# Altium schematic sheet Sheet1.SchDoc
size 381 x 241 mm
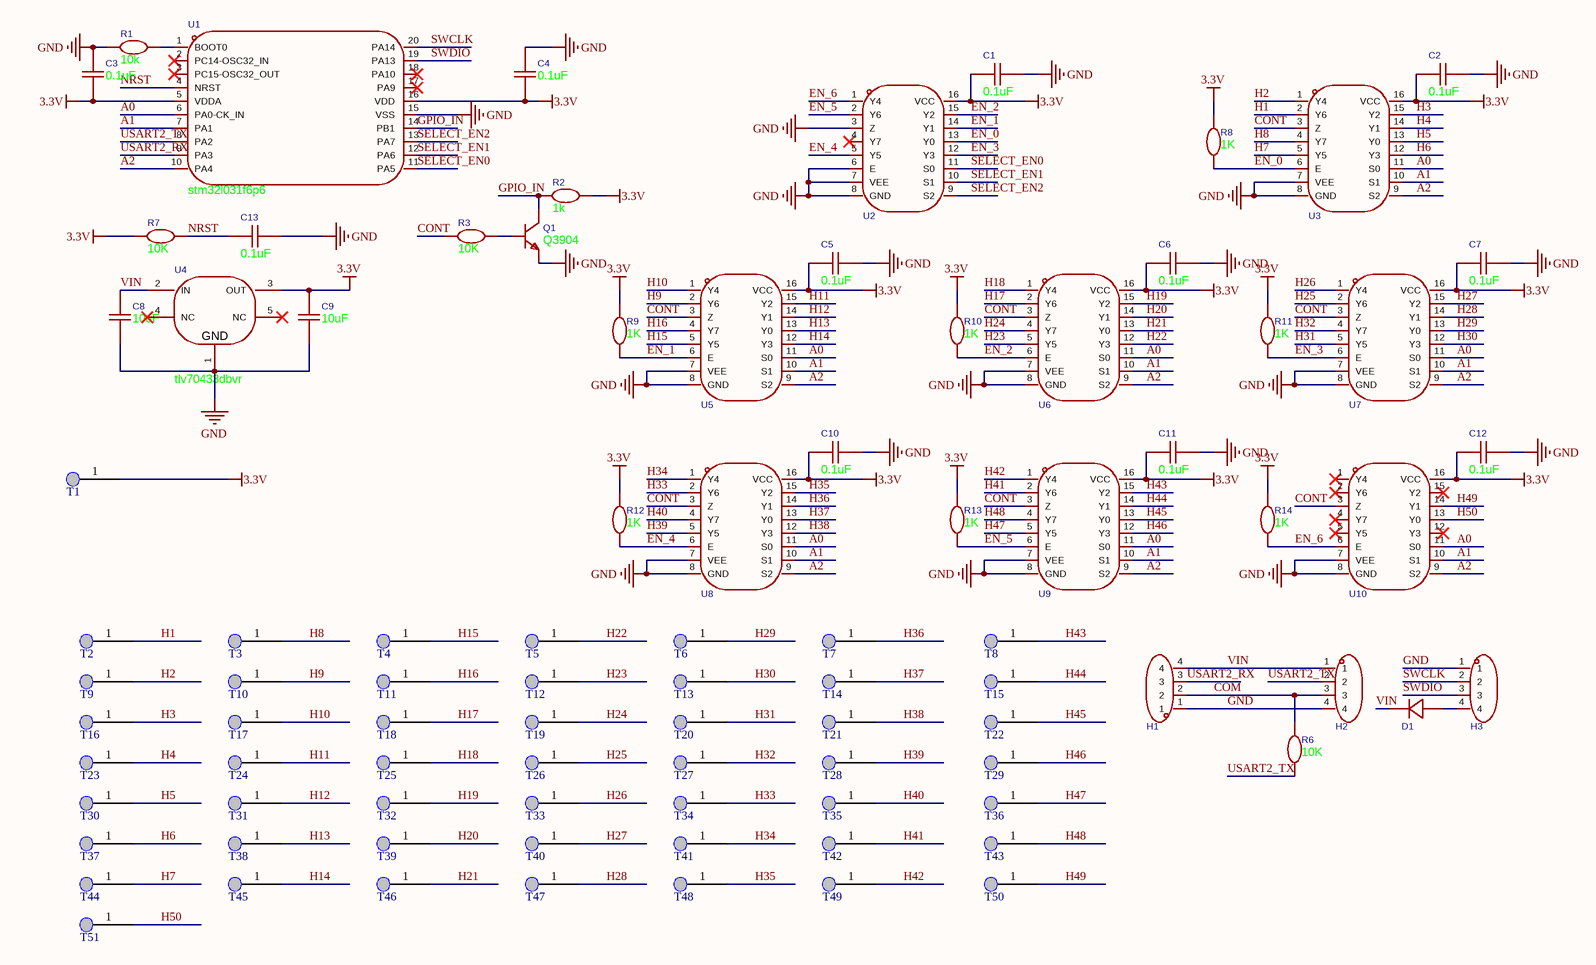
[diagram p0: Sheet1.SchDoc]

## Parts
C1  0.1uF  [C0603]
C2  0.1uF  [C0603]
C3  0.1uF  [C0603]
C4  0.1uF  [C0603]
C5  0.1uF  [C0603]
C6  0.1uF  [C0603]
C7  0.1uF  [C0603]
C8  10uF  [C0603]
C9  10uF  [C0603]
C10  0.1uF  [C0603]
C11  0.1uF  [C0603]
C12  0.1uF  [C0603]
C13  0.1uF  [C0603]
D1  1n4148ws_c7420319  [SOD-323_L1.7-W1.3-LS2.5-FD]  (value not drawn)
H1  pz254v-11-04p  [HDR-TH_4P-P2.54-V-M]  (value not drawn)
H2  pz254v-11-04p  [HDR-TH_4P-P2.54-V-M]  (value not drawn)
H3  pz254v-11-04p  [HDR-TH_4P-P2.54-V-M]  (value not drawn)
Q1  Q3904  [SOT-23-3_L2.9-W1.6-P1.90-LS2.8-BR]
R1  10k  [R0603]
R2  1k  [R0603]
R3  10K  [R0603]
R6  10K  [R0805]
R7  10K  [R0603]
R8  1K  [R0603]
R9  1K  [R0603]
R10  1K  [R0603]
R11  1K  [R0603]
R12  1K  [R0603]
R13  1K  [R0603]
R14  1K  [R0603]
T1  焊盘  [Contact]  (value not drawn)
T2  焊盘  [Contact]  (value not drawn)
T3  焊盘  [Contact]  (value not drawn)
T4  焊盘  [Contact]  (value not drawn)
T5  焊盘  [Contact]  (value not drawn)
T6  焊盘  [Contact]  (value not drawn)
T7  焊盘  [Contact]  (value not drawn)
T8  焊盘  [Contact]  (value not drawn)
T9  焊盘  [Contact]  (value not drawn)
T10  焊盘  [Contact]  (value not drawn)
T11  焊盘  [Contact]  (value not drawn)
T12  焊盘  [Contact]  (value not drawn)
T13  焊盘  [Contact]  (value not drawn)
T14  焊盘  [Contact]  (value not drawn)
T15  焊盘  [Contact]  (value not drawn)
T16  焊盘  [Contact]  (value not drawn)
T17  焊盘  [Contact]  (value not drawn)
T18  焊盘  [Contact]  (value not drawn)
T19  焊盘  [Contact]  (value not drawn)
T20  焊盘  [Contact]  (value not drawn)
T21  焊盘  [Contact]  (value not drawn)
T22  焊盘  [Contact]  (value not drawn)
T23  焊盘  [Contact]  (value not drawn)
T24  焊盘  [Contact]  (value not drawn)
T25  焊盘  [Contact]  (value not drawn)
T26  焊盘  [Contact]  (value not drawn)
T27  焊盘  [Contact]  (value not drawn)
T28  焊盘  [Contact]  (value not drawn)
T29  焊盘  [Contact]  (value not drawn)
T30  焊盘  [Contact]  (value not drawn)
T31  焊盘  [Contact]  (value not drawn)
T32  焊盘  [Contact]  (value not drawn)
T33  焊盘  [Contact]  (value not drawn)
T34  焊盘  [Contact]  (value not drawn)
T35  焊盘  [Contact]  (value not drawn)
T36  焊盘  [Contact]  (value not drawn)
T37  焊盘  [Contact]  (value not drawn)
T38  焊盘  [Contact]  (value not drawn)
T39  焊盘  [Contact]  (value not drawn)
T40  焊盘  [Contact]  (value not drawn)
T41  焊盘  [Contact]  (value not drawn)
T42  焊盘  [Contact]  (value not drawn)
T43  焊盘  [Contact]  (value not drawn)
T44  焊盘  [Contact]  (value not drawn)
T45  焊盘  [Contact]  (value not drawn)
T46  焊盘  [Contact]  (value not drawn)
T47  焊盘  [Contact]  (value not drawn)
T48  焊盘  [Contact]  (value not drawn)
T49  焊盘  [Contact]  (value not drawn)
T50  焊盘  [Contact]  (value not drawn)
T51  焊盘  [Contact]  (value not drawn)
U1  stm32l031f6p6  [TSSOP-20_L6.5-W4.4-P0.65-LS6.4-BL]
U2  74hc4051d,653  [SOIC-16_L9.9-W3.9-P1.27-LS6.0-BL]  (value not drawn)
U3  74hc4051d,653  [SOIC-16_L9.9-W3.9-P1.27-LS6.0-BL]  (value not drawn)
U4  tlv70433dbvr  [SOT-23-5_L3.0-W1.7-P0.95-LS2.8-BR]
U5  74hc4051d,653  [SOIC-16_L9.9-W3.9-P1.27-LS6.0-BL]  (value not drawn)
U6  74hc4051d,653  [SOIC-16_L9.9-W3.9-P1.27-LS6.0-BL]  (value not drawn)
U7  74hc4051d,653  [SOIC-16_L9.9-W3.9-P1.27-LS6.0-BL]  (value not drawn)
U8  74hc4051d,653  [SOIC-16_L9.9-W3.9-P1.27-LS6.0-BL]  (value not drawn)
U9  74hc4051d,653  [SOIC-16_L9.9-W3.9-P1.27-LS6.0-BL]  (value not drawn)
U10  74hc4051d,653  [SOIC-16_L9.9-W3.9-P1.27-LS6.0-BL]  (value not drawn)

## Nets
3.3V: C1.2 C2.2 C3.1 C4.1 C5.2 C6.2 C7.2 C9.2 C10.2 C11.2 C12.2 R2.1 R7.1 R8.2 R9.2 R10.2 R11.2 R12.2 R13.2 R14.2 T1.1 U1.5(VDDA) U1.16(VDD) U2.16(VCC) U3.16(VCC) U4.3(OUT) U5.16(VCC) U6.16(VCC) U7.16(VCC) U8.16(VCC) U9.16(VCC) U10.16(VCC)
GND: C1.1 C2.1 C3.2 C4.2 C5.1 C6.1 C7.1 C8.1 C9.1 C10.1 C11.1 C12.1 C13.2 H1.1 H2.4 H3.1 Q1.2 R1.1 U1.15(VSS) U2.3(Z) U2.6(E) U2.7(VEE) U2.8(GND) U3.7(VEE) U3.8(GND) U4.1(GND) U5.7(VEE) U5.8(GND) U6.7(VEE) U6.8(GND) U7.7(VEE) U7.8(GND) U8.7(VEE) U8.8(GND) U9.7(VEE) U9.8(GND) U10.7(VEE) U10.8(GND)
A0: U1.6(PA0-CK_IN) U3.11(S0) U5.11(S0) U6.11(S0) U7.11(S0) U8.11(S0) U9.11(S0) U10.11(S0)
A1: U1.7(PA1) U3.10(S1) U5.10(S1) U6.10(S1) U7.10(S1) U8.10(S1) U9.10(S1) U10.10(S1)
A2: U1.10(PA4) U3.9(S2) U5.9(S2) U6.9(S2) U7.9(S2) U8.9(S2) U9.9(S2) U10.9(S2)
COM: H1.2 H2.3 R6.2
CONT: R3.1 U3.3(Z) U5.3(Z) U6.3(Z) U7.3(Z) U8.3(Z) U9.3(Z) U10.3(Z)
EN_0: R8.1 U2.13(Y0) U3.6(E)
EN_1: R9.1 U2.14(Y1) U5.6(E)
EN_2: R10.1 U2.15(Y2) U6.6(E)
EN_3: R11.1 U2.12(Y3) U7.6(E)
EN_4: R12.1 U2.5(Y5) U8.6(E)
EN_5: R13.1 U2.2(Y6) U9.6(E)
EN_6: R14.1 U2.1(Y4) U10.6(E)
GPIO_IN: Q1.3 R2.2 U1.14(PB1)
H1: T2.1 U3.2(Y6)
H2: T9.1 U3.1(Y4)
H3: T16.1 U3.15(Y2)
H4: T23.1 U3.14(Y1)
H5: T30.1 U3.13(Y0)
H6: T37.1 U3.12(Y3)
H7: T44.1 U3.5(Y5)
H8: T3.1 U3.4(Y7)
H9: T10.1 U5.2(Y6)
H10: T17.1 U5.1(Y4)
H11: T24.1 U5.15(Y2)
H12: T31.1 U5.14(Y1)
H13: T38.1 U5.13(Y0)
H14: T45.1 U5.12(Y3)
H15: T4.1 U5.5(Y5)
H16: T11.1 U5.4(Y7)
H17: T18.1 U6.2(Y6)
H18: T25.1 U6.1(Y4)
H19: T32.1 U6.15(Y2)
H20: T39.1 U6.14(Y1)
H21: T46.1 U6.13(Y0)
H22: T5.1 U6.12(Y3)
H23: T12.1 U6.5(Y5)
H24: T19.1 U6.4(Y7)
H25: T26.1 U7.2(Y6)
H26: T33.1 U7.1(Y4)
H27: T40.1 U7.15(Y2)
H28: T47.1 U7.14(Y1)
H29: T6.1 U7.13(Y0)
H30: T13.1 U7.12(Y3)
H31: T20.1 U7.5(Y5)
H32: T27.1 U7.4(Y7)
H33: T34.1 U8.2(Y6)
H34: T41.1 U8.1(Y4)
H35: T48.1 U8.15(Y2)
H36: T7.1 U8.14(Y1)
H37: T14.1 U8.13(Y0)
H38: T21.1 U8.12(Y3)
H39: T28.1 U8.5(Y5)
H40: T35.1 U8.4(Y7)
H41: T42.1 U9.2(Y6)
H42: T49.1 U9.1(Y4)
H43: T8.1 U9.15(Y2)
H44: T15.1 U9.14(Y1)
H45: T22.1 U9.13(Y0)
H46: T29.1 U9.12(Y3)
H47: T36.1 U9.5(Y5)
H48: T43.1 U9.4(Y7)
H49: T50.1 U10.14(Y1)
H50: T51.1 U10.13(Y0)
NRST: C13.1 R7.2 U1.4(NRST)
SELECT_EN0: U1.11(PA5) U2.11(S0)
SELECT_EN1: U1.12(PA6) U2.10(S1)
SELECT_EN2: U1.13(PA7) U2.9(S2)
SWCLK: H3.2 U1.20(PA14)
SWDIO: H3.3 U1.19(PA13)
USART2_RX: H1.3 U1.9(PA3)
USART2_TX: H2.2 R6.1 U1.8(PA2)
VIN: C8.2 D1.2(K) H1.4 H2.1 U4.2(IN)
NetD1_1: D1.1(A) H3.4
NetQ1_1: Q1.1 R3.2
NetR1_2: R1.2 U1.1(BOOT0)

Not connected (* = marked no-connect by the designer): U1 2(PC14-OSC32_IN)* 3(PC15-OSC32_OUT)* 17(PA9)* 18(PA10)*; U2 4(Y7)*; U4 4(NC)* 5(NC)*; U10 1(Y4)* 2(Y6)* 4(Y7)* 5(Y5)* 12(Y3)* 15(Y2)*

## Library data of the parts
C1-C13 = C: 容值:100nF;精度:±10%;额定电压:50V;温度系数:X7R;; Manufacturer: SAMSUNG(三星); Symbol: CL10B104KB8NNNC; AddInBom: yes; ModelId: ac125912035d415993ca9572d50418b1; ModelName: C0603_L1.6-W0.8-H0.8; ModelTransform: 62.992,31.496,0,0,0,0,0,0,0; Value: 100nF; Tolerance: ±10%; Voltage Rating: 50V; Temperature Coefficient: X7R; LCSC Part Name: 100nF ±10% 50V; SupplierPart: C1591; ManufacturerPart: CL10B104KB8NNNC; Supplier Footprint: 0603; JLCPCB Part Class: Extended Part; Datasheet: https://item.szlcsc.com/datasheet/CL10B104KB8NNNC/1943.html; Supplier: LCSC; ConvertToPcb: yes; FootprintName: C0603
D1 = 1n4148ws_c7420319: 二极管配置:独立式;整流电流:150mA;直流反向耐压(Vr):100V;正向压降(Vf):1.25V@150mA;反向恢复时间(Trr):4ns;; Manufacturer: R+O(宏嘉诚); AddInBom: yes; ModelId: 0f2f330c645944df9245ac3c3fec3456; ModelTransform: 98.425,49.2125,0,180,0,0,0,0,0; Diode Configuration: 独立式; Pd - Power Dissipation: 200mW; Current - Rectified: 150mA; Voltage - DC Reverse(Vr): 100V; Non-Repetitive Peak Forward Surge Current: 2A; Reverse Leakage Current (Ir): 1uA@75V; Reverse Recovery Time (trr): 4ns; Operating Junction Temperature Range: -55℃~+150℃; Symbol: 1N4148WS_C7420319; LCSC Part Name: 100V 150mA; SupplierPart: C7420319; ManufacturerPart: 1N4148WS; Supplier Footprint: SOD-323; JLCPCB Part Class: Extended Part; Datasheet: https://item.szlcsc.com/datasheet/1N4148WS/8397141.html; Supplier: LCSC; ConvertToPcb: yes; FootprintName: SOD-323_L1.7-W1.3-LS2.5-FD; ModelName: SOD-323_L1.7-W1.3-LS2.5-FD; Voltage - Forward(Vf@If): 1.25V@150mA
H1-H3 = pz254v-11-04p: 插针结构:1x4P;间距:2.54mm;行距:-;圆针/方针:方针;安装方式:直插;排数:单排;总PIN位数:4P;额定电流:3A;额定电压:250V;配合针长度:6mm;塑高:2.5mm;端接针长度:3mm;触头材质:-;工作温度:-40℃~+105℃;颜色:黑色;; Manufacturer: XFCN(兴飞); Symbol: PZ254V-11-04P_C2691448; AddInBom: yes; ModelId: 112f4d05e8d64e99ab9a333894bea4f9; ModelName: HDR-TH_4P-P2.54-M-LI-1X4P; ModelTransform: 399.999,104.7242,0,0,0,0,0,0,-118.11; Pin Structure: 1x4P; Pitch: 2.54mm; Circluar Pins/Square Pins: 方针; Current Rating: 3A; Voltage Rating (Max): 250V; LCSC Part Name: 1x4P 间距:2.54mm 方针 直插; SupplierPart: C2691448; ManufacturerPart: PZ254V-11-04P; Supplier Footprint: 插件,P=2.54mm; JLCPCB Part Class: Extended Part; Datasheet: https://item.szlcsc.com/datasheet/PZ254V-11-04P/2801085.html; Supplier: LCSC; ConvertToPcb: yes; FootprintName: HDR-TH_4P-P2.54-V-M; Row Spacing: -; Mounting Type: 直插; Number of Rows: 单排; Number of Pins: 4P; Length of Mating Pin: 6mm; Insulation Height: 2.5mm; Length of End Connection Pin: 3mm; Contact Material: -; Operating Temperature: -40℃~+105℃; Color: 黑色
Q1 = Q3904: 晶体管类型:NPN;集电极电流(Ic):200mA;集射极击穿电压(Vceo):40V;耗散功率(Pd):225mW;直流电流增益(hFE):40@0.1mA,1.0V;; Manufacturer: onsemi(安森美); Symbol: MMBT3904LT1G; AddInBom: yes; ModelId: 89cb27a44ab2466697082bb9fd73a7d0; ModelName: SOT-23-3L_L2.9-W1.6-H1.1-LS2.8-P0.95; ModelTransform: 114.173,110.236,0,90,0,0,0,0,0; type: NPN; Current - Collector(Ic): 200mA; Collector - Emitter Voltage VCEO: 40V; Pd - Power Dissipation: 225mW; Transition frequency(fT): 300MHz; Current - Collector Cutoff: 50nA; Vce Saturation(VCE(sat)): 200mV; LCSC Part Name: NPN 电流:200mA 电压:40V; SupplierPart: C81464; ManufacturerPart: MMBT3904LT1G; Supplier Footprint: SOT-23; JLCPCB Part Class: Extended Part; Datasheet: https://item.szlcsc.com/datasheet/MMBT3904LT1G/82615.html; Supplier: LCSC; ConvertToPcb: yes; FootprintName: SOT-23-3_L2.9-W1.6-P1.90-LS2.8-BR; DC Current Gain: 40@0.1mA,1.0V; Operating Temperature: -55℃~+150℃
R1-R3 R7-R14 = R: 电阻类型:厚膜电阻;阻值:1kΩ;精度:±1%;功率:100mW;工作电压:75V;温度系数:±100ppm/℃;; Manufacturer: FOJAN(富捷); Symbol: FRC0603F1001TS; AddInBom: yes; ModelId: fc143cca1e79419f9cd78b61e9279f08; ModelTransform: 31.8897,63.7794,0,90,0,0,0,0,0; Value: 1kΩ; Tolerance: ±1%; Power(Watts): 100mW; Voltage-Supply(Max): 75V; LCSC Part Name: 1kΩ ±1% 100mW 厚膜电阻; SupplierPart: C2907002; ManufacturerPart: FRC0603F1001TS; Supplier Footprint: 0603; JLCPCB Part Class: Extended Part; Supplier: LCSC; ConvertToPcb: yes; FootprintName: R0603; ModelName: R0603; Type: 厚膜电阻; Temperature Coefficient: ±100ppm/℃; Operating Temperature: -55℃~+155℃
R6 = R: 电阻类型:厚膜电阻;阻值:1kΩ;精度:±1%;功率:100mW;工作电压:75V;温度系数:±100ppm/℃;; Manufacturer: FOJAN(富捷); Symbol: FRC0603F1001TS; AddInBom: yes; ModelId: fc143cca1e79419f9cd78b61e9279f08; ModelName: R0603; ModelTransform: 31.8897,63.7794,0,90,0,0,0,0,0; Value: 1kΩ; Tolerance: ±1%; Power(Watts): 100mW; Voltage-Supply(Max): 75V; LCSC Part Name: 1kΩ ±1% 100mW 厚膜电阻; SupplierPart: C2907002; ManufacturerPart: FRC0603F1001TS; Supplier Footprint: 0603; JLCPCB Part Class: Extended Part; Supplier: LCSC; ConvertToPcb: yes; FootprintName: R0603; Type: 厚膜电阻; Temperature Coefficient: ±100ppm/℃; Operating Temperature: -55℃~+155℃
T1-T51 = PAD
U1 = stm32l031f6p6: CPU内核:-;CPU最大主频:32MHz;; Manufacturer: ST(意法半导体); AddInBom: yes; ModelId: c491f68934b34c649df5890a1d97cd0f; ModelName: TSSOP-20_L6.5-W4.4-H1.0-LS6.4-P0.65; ModelTransform: 251.969,255.906,0,90,0,0,0.0005,0,0; CPU Maximum Speed: 32MHz; Program Storage Size: 32KB; Program Memory Type: FLASH; Number of I/O: 15; ADC (Bit): 12bit; Voltage - Supply: 1.8V~3.6V; Symbol: STM32L031F6P6; LCSC Part Name: 超低功耗Arm Cortex-M0+ MCU，具有32-KB Flash存储器和32 MHz CPU; SupplierPart: C115208; ManufacturerPart: STM32L031F6P6; Supplier Footprint: TSSOP-20; JLCPCB Part Class: Extended Part; Datasheet: https://item.szlcsc.com/datasheet/STM32L031F6P6/116454.html; Supplier: LCSC; ConvertToPcb: yes; FootprintName: TSSOP-20_L6.5-W4.4-P0.65-LS6.4-BL; CPU Core: -
U2 U3 U5-U10 = 74hc4051d,653: 开关电路:8:1;通道数:1;导通电阻(Ron):80Ω;; Manufacturer: Nexperia(安世); AddInBom: yes; ModelId: c21ec766ec2643efb3352f8441994f4e; ModelName: SOIC-16_L9.9-W3.9-H1.8-LS6.0-P1.27; ModelTransform: 389.763,236.454,0,0,0,0,0,0,0; Switch Circuit: 8:1; Number of Channels: 1; Ron: 80Ω; Voltage - Supply: 2V~10V; Turn-on time: 29ns; Turn-off time: 31ns; Propagation Delay (tpd): 5ns; Symbol: 74HC4051D,653; LCSC Part Name: 8通道模拟多路复用器/解复用器; SupplierPart: C9386; ManufacturerPart: 74HC4051D,653; Supplier Footprint: SOIC-16; JLCPCB Part Class: Extended Part; Datasheet: https://item.szlcsc.com/datasheet/74HC4051D%252C653/9915.html; Supplier: LCSC; ConvertToPcb: yes; FootprintName: SOIC-16_L9.9-W3.9-P1.27-LS6.0-BL; Con: -; Bandwidth: -; Operating Temperature: -40℃~+125℃; Features: 电平转换
U4 = tlv70433dbvr: 输出极性:正极;工作电压:24V;输出电压:3.3V;输出电流:150mA;电源纹波抑制比(PSRR):60dB@(100kHz);输出类型:固定;; Manufacturer: TI(德州仪器); AddInBom: yes; ModelId: 0a2a1b8f50944f73965918ad6e5fe167; ModelName: SOT-23-5_L2.9-W1.6-H1.1-LS2.8-P0.95; ModelTransform: 114.173,109.636,0,180,0,0,0,0,0; Output Configuration: 正极; Voltage - Supply: 24V; Output Voltage: 3.3V; Output Current: 150mA; Voltage Dropout: 850mV@(100mA); standby current: 3.2uA; Output Type: 固定; Number of Outputs: 1; Symbol: TLV70433DBVR; LCSC Part Name: 3.3V 150mA 24V; SupplierPart: C94917; ManufacturerPart: TLV70433DBVR; Supplier Footprint: SOT-23-5; JLCPCB Part Class: Extended Part; Datasheet: https://www.ti.com/cn/lit/ds/symlink/tlv704.pdf; Supplier: LCSC; ConvertToPcb: yes; FootprintName: SOT-23-5_L3.0-W1.7-P0.95-LS2.8-BR; Power Supply Rejection Ratio (PSRR): 60dB@(100kHz); Noise: -; Features: 短路保护；过流保护；使能控制; Operating Temperature: -40℃~+125℃@(Tj)